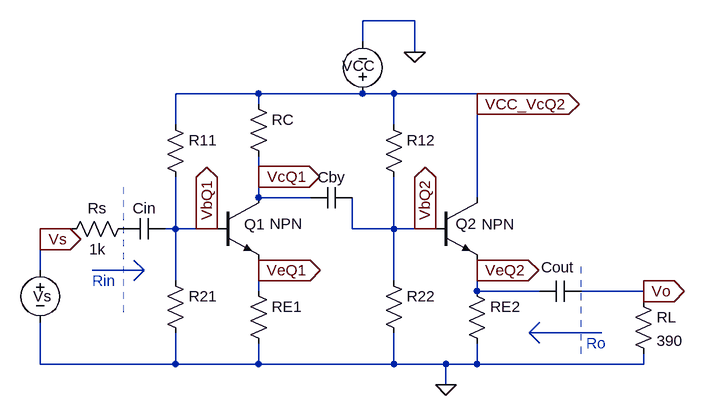
[diagram p0: schematic lab_schem_Rin_and_Rout.asc]
lab_schem_Rin_and_Rout.asc, the LTspice schematic file:
Version 4
SHEET 1 1088 680
WIRE 416 -160 336 -160
WIRE 336 -128 336 -160
WIRE 416 -112 416 -160
WIRE 176 -48 48 -48
WIRE 336 -48 176 -48
WIRE 384 -48 336 -48
WIRE 512 -48 384 -48
WIRE 176 -32 176 -48
WIRE 512 -32 512 -48
WIRE 48 0 48 -48
WIRE 384 0 384 -48
WIRE 176 80 176 48
WIRE 176 112 176 80
WIRE 256 112 176 112
WIRE 512 112 512 -32
WIRE -112 160 -160 160
WIRE 48 160 48 80
WIRE 48 160 32 160
WIRE 96 160 48 160
WIRE 112 160 96 160
WIRE 320 160 320 112
WIRE 384 160 384 80
WIRE 384 160 320 160
WIRE 432 160 384 160
WIRE 448 160 432 160
WIRE -160 176 -160 160
WIRE -160 224 -160 176
WIRE 176 224 176 208
WIRE 512 224 512 208
WIRE 48 240 48 160
WIRE 384 240 384 160
WIRE 176 256 176 224
WIRE 512 256 512 224
WIRE 608 256 512 256
WIRE 768 256 672 256
WIRE 768 272 768 256
WIRE -160 368 -160 304
WIRE 48 368 48 320
WIRE 48 368 -160 368
WIRE 176 368 176 336
WIRE 176 368 48 368
WIRE 384 368 384 320
WIRE 384 368 176 368
WIRE 464 368 384 368
WIRE 512 368 512 336
WIRE 512 368 464 368
WIRE 768 368 768 352
WIRE 768 368 512 368
WIRE 464 400 464 368
FLAG 416 -112 0
FLAG 464 400 0
FLAG 768 256 Vo
IOPIN 768 256 Out
FLAG 512 -32 VCC_VcQ2
IOPIN 512 -32 Out
FLAG 432 160 VbQ2
IOPIN 432 160 Out
FLAG 96 160 VbQ1
IOPIN 96 160 Out
FLAG 176 224 VeQ1
IOPIN 176 224 Out
FLAG 176 80 VcQ1
IOPIN 176 80 Out
FLAG 512 224 VeQ2
IOPIN 512 224 Out
FLAG -160 176 Vs
IOPIN -160 176 Out
SYMBOL cap 320 96 R90
WINDOW 0 0 32 VBottom 2
WINDOW 3 32 32 VTop 2
SYMATTR InstName Cby
SYMATTR Value ""
SYMBOL res 32 -16 R0
SYMATTR InstName R11
SYMATTR Value ""
SYMBOL res 32 224 R0
SYMATTR InstName R21
SYMATTR Value ""
SYMBOL res 368 -16 R0
WINDOW 3 -33 28 Left 2
SYMATTR Value ""
SYMATTR InstName R12
SYMBOL res 368 224 R0
SYMATTR InstName R22
SYMATTR Value ""
SYMBOL res 160 -48 R0
SYMATTR InstName RC
SYMATTR Value ""
SYMBOL res 160 240 R0
SYMATTR InstName RE1
SYMATTR Value ""
SYMBOL res 496 240 R0
SYMATTR InstName RE2
SYMATTR Value ""
SYMBOL res 752 256 R0
SYMATTR InstName RL
SYMATTR Value 390
SYMBOL voltage 336 -32 R180
WINDOW 0 -19 59 Left 2
WINDOW 3 -37 99 Left 2
WINDOW 123 0 0 Left 0
WINDOW 39 0 0 Left 0
SYMATTR InstName VCC
SYMATTR Value ""
SYMBOL voltage -160 208 R0
WINDOW 0 -11 56 Left 2
WINDOW 3 39 70 Left 1
WINDOW 123 43 89 Left 1
WINDOW 39 0 0 Left 0
SYMATTR InstName Vs
SYMATTR Value ""
SYMBOL cap 672 240 R90
WINDOW 0 -5 36 VBottom 2
WINDOW 3 23 5 VTop 2
SYMATTR InstName Cout
SYMATTR Value ""
SYMBOL cap 32 144 R90
WINDOW 0 0 32 VBottom 2
WINDOW 3 32 32 VTop 2
SYMATTR InstName Cin
SYMATTR Value ""
SYMBOL res -16 144 R90
WINDOW 0 0 56 VBottom 2
WINDOW 3 32 56 VTop 2
SYMATTR InstName Rs
SYMATTR Value 1k
SYMBOL npn 112 112 R0
WINDOW 0 42 41 Left 2
WINDOW 3 81 40 Left 2
SYMATTR InstName Q1
SYMBOL npn 448 112 R0
WINDOW 0 31 40 Left 2
WINDOW 3 71 41 Left 2
SYMATTR InstName Q2
TEXT -80 240 Left 2 ;Rin
TEXT 680 336 Left 2 ;Ro
LINE Normal -32 288 -32 96 2
LINE Normal -32 288 -32 288 2
LINE Normal -32 288 -32 288 2
LINE Normal -32 288 -32 288 2
LINE Normal 0 224 -80 224
LINE Normal -80 224 0 224 2
LINE Normal -16 208 0 224
LINE Normal -16 240 0 224
LINE Normal 672 352 672 208 2
LINE Normal 672 352 672 352 2
LINE Normal 672 352 672 352 2
LINE Normal 592 320 704 320
LINE Normal 608 304 592 320
LINE Normal 608 336 592 320

The netlist it stands for:
* lab_schem_Rin_and_Rout.asc
Cby VbQ2 VcQ1
R11 VCC_VcQ2 VbQ1
R21 VbQ1 0
R12 VCC_VcQ2 VbQ2
R22 VbQ2 0
RC VCC_VcQ2 VcQ1
RE1 VeQ1 0
RE2 VeQ2 0
RL Vo 0 390
VCC VCC_VcQ2 0
Vs Vs 0
Cout Vo VeQ2
Cin VbQ1 P001
Rs P001 Vs 1k
Q1 VcQ1 VbQ1 VeQ1 0 NPN
Q2 VCC_VcQ2 VbQ2 VeQ2 0 NPN
.model NPN NPN
.model PNP PNP
.lib standard.bjt
* Rin
* Ro
.backanno
.end